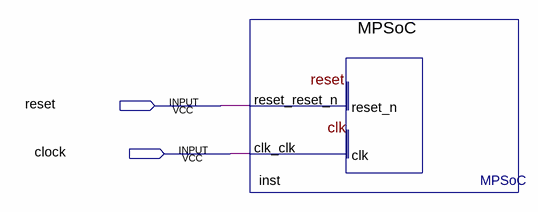
[diagram p0: schematic sheet]
// Quartus schematic TopLevel.bdf as structural Verilog: 1 symbols, 2 pins
module TopLevel (
  input  reset,
  input  clock
);

  MPSoC inst (.reset_reset_n(reset), .clk_clk(clock));
endmodule
